# Altium schematic sheet Radio.SchDoc
size B
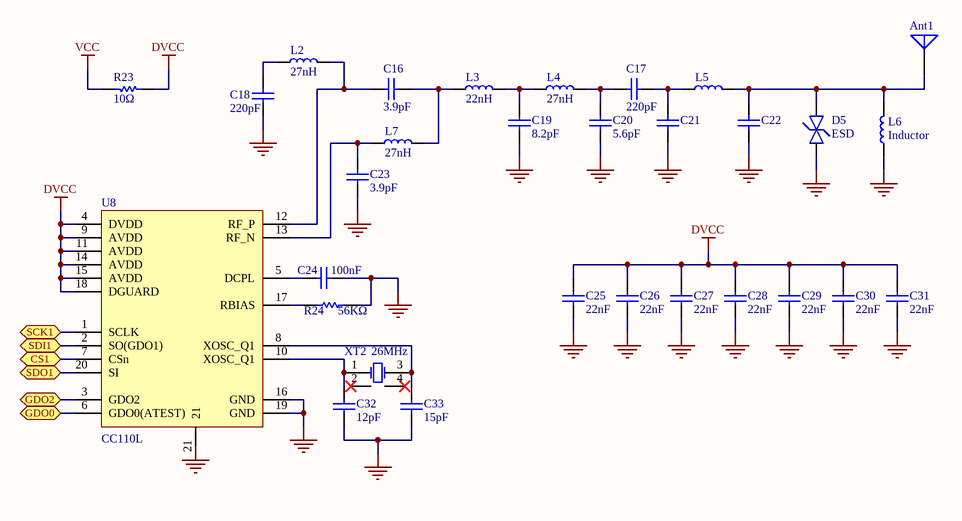
[diagram p0: Radio.SchDoc]

## Parts
Ant1  Antenna  [35 mil hole]  (value not drawn)
C16  3.9pF  [0402 Small]
C17  220pF  [0402 Small]
C18  220pF  [0402 Small]
C19  8.2pF  [0402 Small]
C20  5.6pF  [0402 Small]
C21  NP  [0402 Small]  (value not drawn)
C22  NP  [0402 Small]  (value not drawn)
C23  3.9pF  [0402 Small]
C24  100nF  [0402 Small]
C25  22nF  [0402 Small]
C26  22nF  [0402 Small]
C27  22nF  [0402 Small]
C28  22nF  [0402 Small]
C29  22nF  [0402 Small]
C30  22nF  [0402 Small]
C31  22nF  [0402 Small]
C32  12pF  [0402 Small]
C33  15pF  [0402 Small]
D5  ESD  [XDFN2]
L2  27nH  [0402 Small]
L3  22nH  [0402 Small]
L4  27nH  [0402 Small]
L5  NP  [0402 Small]  (value not drawn)
L6  Inductor  [0402 Small]
L7  27nH  [0402 Small]
R23  10Ω  [0603 Small]
R24  56KΩ  [0402 Small]
U8  CC110L  [VQFN-20]
XT2  26MHz  [CFPX-5]

## Ports
CS1 (bidir), GDO0 (bidir), GDO2 (bidir), SCK1 (bidir), SDI1 (bidir), SDO1 (bidir)

## Nets
DVCC: C25.2 C26.2 C27.2 C28.2 C29.2 C30.2 C31.2 R23.2 U8.4(DVDD) U8.9(AVDD) U8.11(AVDD) U8.14(AVDD) U8.15(AVDD) U8.18(DGUARD)
GND: C18.1 C19.2 C20.2 C21.2 C22.2 C23.2 C24.1 C25.1 C26.1 C27.1 C28.1 C29.1 C30.1 C31.1 C32.1 C33.1 D5.1 L6.1 R24.2 U8.16(GND) U8.19(GND) U8.21
VCC: R23.1
CS1: U8.7(CSn) ; port CS1
GDO0: U8.6(GDO0(ATEST)) ; port GDO0
GDO2: U8.3(GDO2) ; port GDO2
SCK1: U8.1(SCLK) ; port SCK1
SDI1: U8.2(SO(GDO1)) ; port SDI1
SDO1: U8.20(SI) ; port SDO1
NetAnt1_1: Ant1.1(A) C22.1 D5.2 L5.2 L6.2
NetC16_1: C16.1 L3.1 L7.2
NetC16_2: C16.2 L2.2 U8.12(RF_P)
NetC17_1: C17.1 C20.1 L4.2
NetC17_2: C17.2 C21.1 L5.1
NetC18_2: C18.2 L2.1
NetC19_1: C19.1 L3.2 L4.1
NetC23_1: C23.1 L7.1 U8.13(RF_N)
NetC24_2: C24.2 U8.5(DCPL)
NetC32_2: C32.2 U8.10(XOSC_Q1) XT2.1(OSC1)
NetC33_2: C33.2 U8.8(XOSC_Q1) XT2.3
NetR24_1: R24.1 U8.17(RBIAS)

Not connected (* = marked no-connect by the designer): XT2 2(OSC2)* 4*

## Notes on the sheet
- Title
- Size:
- Date:
- B
- Number:
- Time:
- Revision:
- Sheet
- of
- File:

## Library data of the parts
Ant1 = Antenna: 6.8" Whip Antenna; Manufacturer: Alpha Wire; Manufacturer#: 422607 YL005; Cost: .18615; Length: 6.8
C16 C23 = Cap: Capacitor, 3.9p, 0402, NP0, +-0.25pF, 50V; Manufacturer: MURATA ELECTRONICS; Manufacturer#: GRM1555C1H3R9CA01D; Cost: 0.0069
C17 C18 = Cap: Capacitor, 220p, 0402, NP0, 5%, 50V; Manufacturer: MURATA ELECTRONICS; Manufacturer#: GRM1555C1H221JA01D; Cost: 0.0078
C19 = Cap: Capacitor, 8.2p, 0402, NP0, +-0.25pF, 50V; Manufacturer: MURATA ELECTRONICS; Manufacturer#: GRM1555C1H8R2CA01D; Cost: 0.0069
C20 = Cap: Capacitor, 5.6p, 0402, NP0, +-0.25pF, 50V; Manufacturer: MURATA ELECTRONICS; Manufacturer#: GRM1555C1H5R6CA01D; Cost: 0.0069
C21 C22 = Cap: Cost: 0
C24 = Cap: Capacitor, 100n, 0402, X5R, 10%, 10V; Manufacturer: MURATA ELECTRONICS; Manufacturer#: GRM155R71A104KA01D; Cost: 0.0066
C25-C31 = Cap: Capacitor, 22n, 0402, X7R, 10%, 25V; Manufacturer: MURATA ELECTRONICS; Manufacturer#: GRM155R71E223KA61J; Cost: 0.0100
C32 = Cap: CAP CER 12PF 50V 5% NP0 0402; Manufacturer: MURATA ELECTRONICS; Manufacturer#: GRM1555C1H120JA01D; Cost: 0.0042
C33 = Cap: CAP CER 15PF 50V 5% NP0 0402; Manufacturer: MURATA ELECTRONICS; Manufacturer#: GRM1555C1H150JA01D; Cost: 0.00525
D5 = BiDi: TVS DIODE 16VWM 39VC 2XDFN; Manufacturer: ON Semiconductor; Manufacturer#: SZESD7461N2T5G; Cost: 0.15743
L2 L4 L7 = Inductor: Inductor, 27n, 0402, ±5%; Manufacturer: MURATA ELECTRONICS; Manufacturer#: LQG15HS27NJ02D; Cost: 0.0304
L3 = Inductor: Inductor, 22n, 0402, ±5%; Manufacturer: MURATA ELECTRONICS; Manufacturer#: LQG15HS22NJ02D; Cost: 0.0304
L5 = Inductor: Cost: 0
L6 = Inductor: Fixed Inductors 0.68uH; Manufacturer: TDK; Manufacturer#: MLF1005LR68K; Cost: 0.126
R23 = Res1: Thick Film Resistors - SMD 1/10watt 10ohms 1%; Manufacturer: Vishay Semiconductors; Manufacturer#: CRCW060310R0FKEB; Cost: 0.080
R24 = Res1: Resistor, 56k ohms, 0402,  ±1%; Manufacturer: Koa; Manufacturer#: RK73H1ETTP5602F; Cost: 0.003
U8 = CC1101: IC RF VALUE LINE TXRX 20QFN; Manufacturer: Texas Instruments; Manufacturer#: CC110LRGP; Cost: 1.8488
XT2 = CRYS: CRYSTAL 26MHZ 10PF SMD; Manufacturer: Suntsu; Manufacturer#: SCX572-26000MHZ; Cost: 0.3696